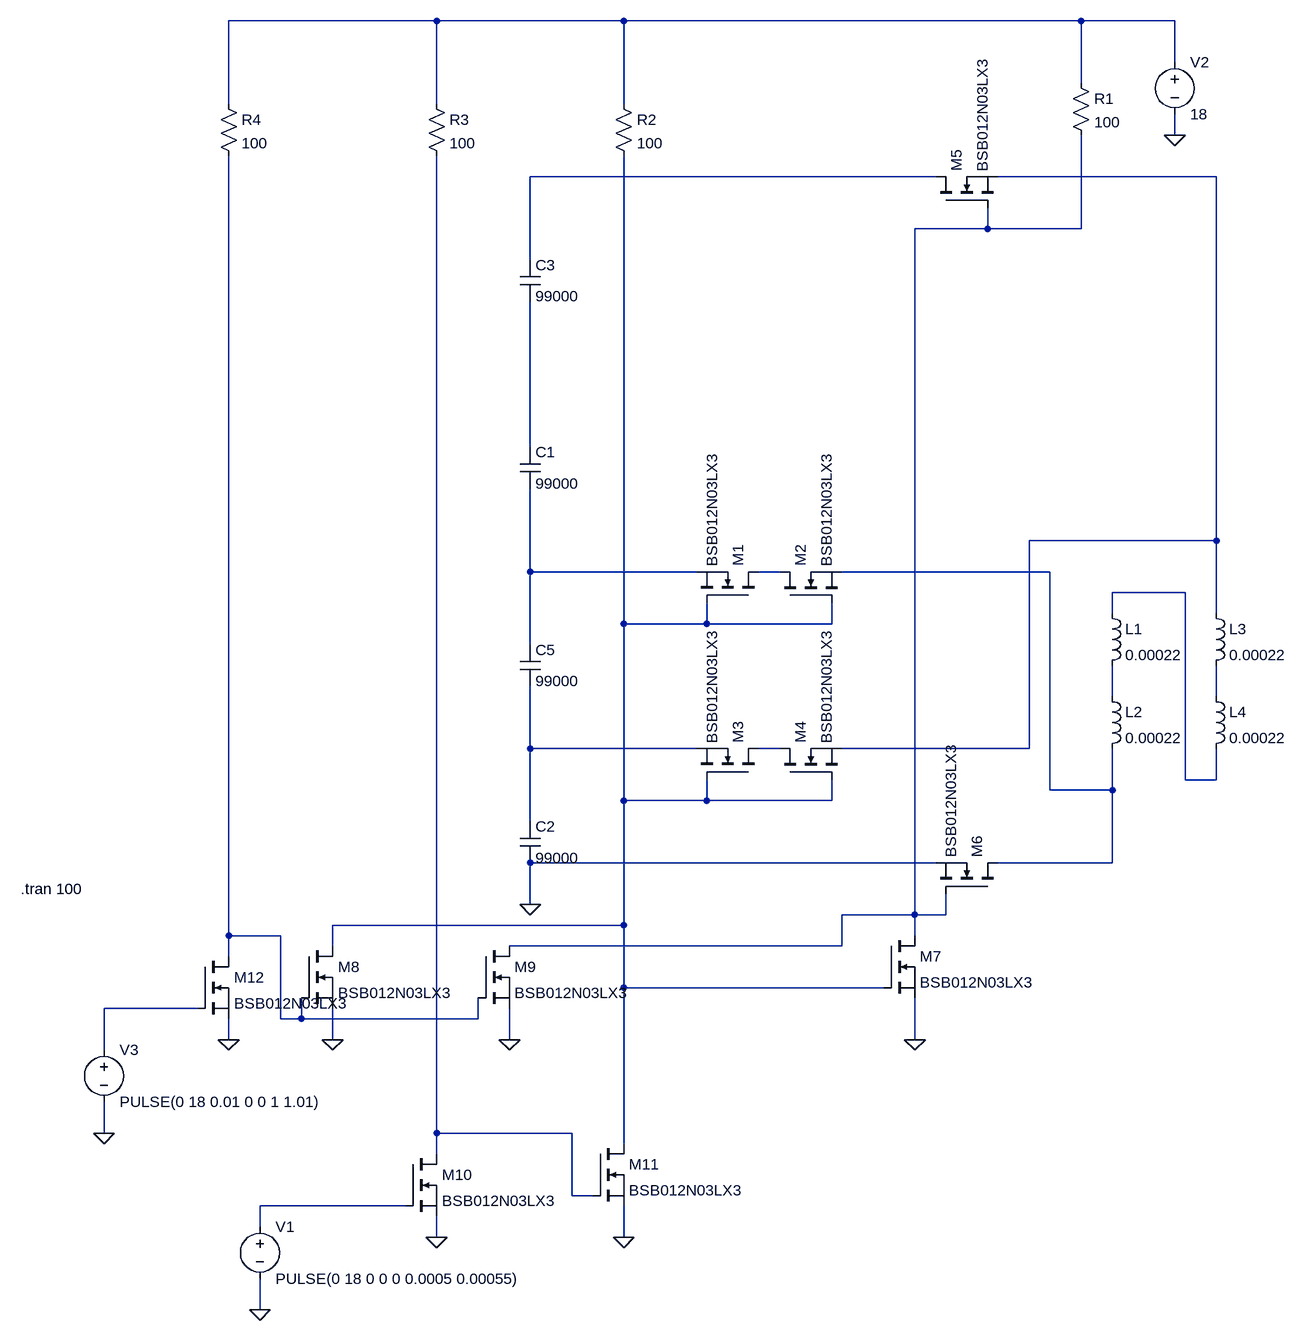
[diagram p0: schematic balance_inductance_v3.asc]
balance_inductance_v3.asc, the LTspice schematic file:
Version 4
SHEET 1 1532 852
WIRE -160 -1248 -480 -1248
WIRE 128 -1248 -160 -1248
WIRE 832 -1248 128 -1248
WIRE 976 -1248 832 -1248
WIRE 976 -1184 976 -1248
WIRE 832 -1152 832 -1248
WIRE -480 -1120 -480 -1248
WIRE -160 -1120 -160 -1248
WIRE 128 -1120 128 -1248
WIRE 976 -1072 976 -1104
WIRE 608 -1008 -16 -1008
WIRE 1040 -1008 704 -1008
WIRE 688 -928 688 -960
WIRE 688 -928 576 -928
WIRE 832 -928 832 -1072
WIRE 832 -928 688 -928
WIRE -16 -880 -16 -1008
WIRE -16 -592 -16 -816
WIRE 1040 -448 1040 -1008
WIRE 1040 -448 752 -448
WIRE -16 -400 -16 -528
WIRE 240 -400 -16 -400
WIRE 368 -400 336 -400
WIRE 784 -400 464 -400
WIRE 992 -368 880 -368
WIRE 880 -336 880 -368
WIRE 1040 -336 1040 -448
WIRE 128 -320 128 -1040
WIRE 256 -320 256 -352
WIRE 256 -320 128 -320
WIRE 448 -320 448 -352
WIRE 448 -320 256 -320
WIRE -16 -288 -16 -400
WIRE 880 -208 880 -256
WIRE 1040 -208 1040 -256
WIRE -16 -128 -16 -224
WIRE 240 -128 -16 -128
WIRE 368 -128 336 -128
WIRE 752 -128 752 -448
WIRE 752 -128 464 -128
WIRE 992 -80 992 -368
WIRE 1040 -80 1040 -128
WIRE 1040 -80 992 -80
WIRE 784 -64 784 -400
WIRE 880 -64 880 -128
WIRE 880 -64 784 -64
WIRE 128 -48 128 -320
WIRE 256 -48 256 -80
WIRE 256 -48 128 -48
WIRE 448 -48 448 -80
WIRE 448 -48 256 -48
WIRE -16 -16 -16 -128
WIRE 608 48 -16 48
WIRE 880 48 880 -64
WIRE 880 48 704 48
WIRE -16 112 -16 48
WIRE 576 128 576 -928
WIRE 576 128 464 128
WIRE 624 128 624 96
WIRE 624 128 576 128
WIRE 128 144 128 -48
WIRE 128 144 -320 144
WIRE -480 160 -480 -1040
WIRE -400 160 -480 160
WIRE 576 160 576 128
WIRE -320 176 -320 144
WIRE 464 176 464 128
WIRE 464 176 -48 176
WIRE -480 192 -480 160
WIRE 128 240 128 144
WIRE 528 240 128 240
WIRE -528 272 -672 272
WIRE -400 288 -400 160
WIRE -368 288 -368 256
WIRE -368 288 -400 288
WIRE -96 288 -96 256
WIRE -96 288 -368 288
WIRE -480 320 -480 288
WIRE -320 320 -320 272
WIRE -48 320 -48 272
WIRE 576 320 576 256
WIRE -672 336 -672 272
WIRE -672 464 -672 416
WIRE -160 464 -160 -1040
WIRE 48 464 -160 464
WIRE 128 480 128 240
WIRE -160 496 -160 464
WIRE 48 560 48 464
WIRE 80 560 48 560
WIRE -208 576 -432 576
WIRE -432 608 -432 576
WIRE -160 624 -160 592
WIRE 128 624 128 576
WIRE -432 736 -432 688
FLAG -16 112 0
FLAG 976 -1072 0
FLAG -432 736 0
FLAG 576 320 0
FLAG -672 464 0
FLAG -320 320 0
FLAG -48 320 0
FLAG -160 624 0
FLAG 128 624 0
FLAG -480 320 0
SYMBOL cap -32 -16 R0
SYMATTR InstName C2
SYMATTR Value 99000
SYMATTR SpiceLine Rser=0.2,IC=3.2
SYMBOL voltage -432 592 R0
WINDOW 123 0 0 Left 0
WINDOW 39 0 0 Left 0
SYMATTR InstName V1
SYMATTR Value PULSE(0 18 0 0 0 0.0005 0.00055)
SYMBOL cap -32 -288 R0
SYMATTR InstName C5
SYMATTR Value 99000
SYMATTR SpiceLine Rser=0.2,IC=3.3
SYMBOL cap -32 -592 R0
SYMATTR InstName C1
SYMATTR Value 99000
SYMATTR SpiceLine Rser=0.2,IC=3.2
SYMBOL cap -32 -880 R0
SYMATTR InstName C3
SYMATTR Value 99000
SYMATTR SpiceLine Rser=0.2,IC=3.2
SYMBOL nmos 336 -352 M270
SYMATTR InstName M1
SYMATTR Value BSB012N03LX3
SYMBOL nmos 368 -352 R270
SYMATTR InstName M2
SYMATTR Value BSB012N03LX3
SYMBOL nmos 336 -80 M270
SYMATTR InstName M3
SYMATTR Value BSB012N03LX3
SYMBOL nmos 368 -80 R270
SYMATTR InstName M4
SYMATTR Value BSB012N03LX3
SYMBOL ind 864 -352 R0
SYMATTR InstName L1
SYMATTR Value 0.00022
SYMATTR SpiceLine Rser=0.439
SYMBOL ind 864 -224 R0
SYMATTR InstName L2
SYMATTR Value 0.00022
SYMATTR SpiceLine Rser=0.439
SYMBOL ind 1024 -352 R0
SYMATTR InstName L3
SYMATTR Value 0.00022
SYMATTR SpiceLine Rser=0.439
SYMBOL ind 1024 -224 R0
SYMATTR InstName L4
SYMATTR Value 0.00022
SYMATTR SpiceLine Rser=0.439
SYMBOL nmos 608 -960 R270
SYMATTR InstName M5
SYMATTR Value BSB012N03LX3
SYMBOL nmos 704 96 M270
SYMATTR InstName M6
SYMATTR Value BSB012N03LX3
SYMBOL res 816 -1168 R0
SYMATTR InstName R1
SYMATTR Value 100
SYMBOL voltage 976 -1200 R0
WINDOW 123 0 0 Left 0
WINDOW 39 0 0 Left 0
SYMATTR InstName V2
SYMATTR Value 18
SYMBOL nmos 528 160 R0
SYMATTR InstName M7
SYMATTR Value BSB012N03LX3
SYMBOL voltage -672 320 R0
WINDOW 123 0 0 Left 0
WINDOW 39 0 0 Left 0
SYMATTR InstName V3
SYMATTR Value PULSE(0 18 0.01 0 0 1 1.01)
SYMBOL nmos -368 176 R0
SYMATTR InstName M8
SYMATTR Value BSB012N03LX3
SYMBOL nmos -96 176 R0
SYMATTR InstName M9
SYMATTR Value BSB012N03LX3
SYMBOL nmos -208 496 R0
SYMATTR InstName M10
SYMATTR Value BSB012N03LX3
SYMBOL nmos 80 480 R0
SYMATTR InstName M11
SYMATTR Value BSB012N03LX3
SYMBOL res 112 -1136 R0
SYMATTR InstName R2
SYMATTR Value 100
SYMBOL res -176 -1136 R0
SYMATTR InstName R3
SYMATTR Value 100
SYMBOL nmos -528 192 R0
SYMATTR InstName M12
SYMATTR Value BSB012N03LX3
SYMBOL res -496 -1136 R0
SYMATTR InstName R4
SYMATTR Value 100
TEXT -800 88 Left 2 !.tran 100

The netlist it stands for:
* balance_inductance_v3.asc
C2 N013 0 99000 Rser=0.2,IC=3.2
V1 N018 0 PULSE(0 18 0 0 0 0.0005 0.00055)
C5 N006 N013 99000 Rser=0.2,IC=3.3
C1 N005 N006 99000 Rser=0.2,IC=3.2
C3 N002 N005 99000 Rser=0.2,IC=3.2
M1 N007 N010 N006 N006 BSB012N03LX3
M2 N007 N010 N008 N008 BSB012N03LX3
M3 N014 N010 N013 N013 BSB012N03LX3
M4 N014 N010 N003 N003 BSB012N03LX3
L1 N009 N011 0.00022 Rser=0.439
L2 N011 N008 0.00022 Rser=0.439
L3 N003 N012 0.00022 Rser=0.439
L4 N012 N009 0.00022 Rser=0.439
M5 N002 N004 N003 N003 BSB012N03LX3
M6 N008 N004 0 0 BSB012N03LX3
R1 N001 N004 100
V2 N001 0 18
M7 N004 N010 0 0 BSB012N03LX3
V3 N016 0 PULSE(0 18 0.01 0 0 1 1.01)
M8 N010 N015 0 0 BSB012N03LX3
M9 N004 N015 0 0 BSB012N03LX3
M10 N017 N018 0 0 BSB012N03LX3
M11 N010 N017 0 0 BSB012N03LX3
R2 N001 N010 100
R3 N001 N017 100
M12 N015 N016 0 0 BSB012N03LX3
R4 N001 N015 100
.model NMOS NMOS
.model PMOS PMOS
.lib standard.mos
.tran 100
.backanno
.end